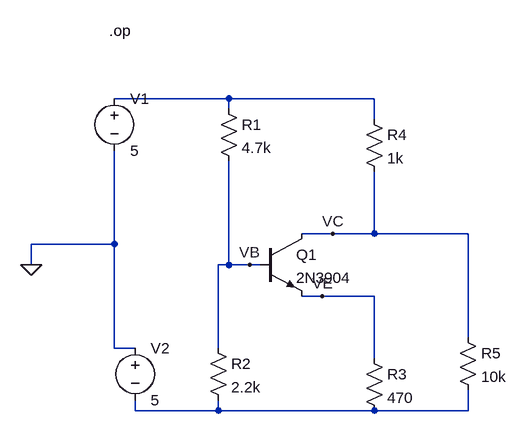
[diagram p0: schematic transistor.asc]
transistor.asc, the LTspice schematic file:
Version 4.1
SHEET 1 880 680
WIRE 80 -160 -96 -160
WIRE 304 -160 80 -160
WIRE 80 -144 80 -160
WIRE 304 -128 304 -160
WIRE 240 48 192 48
WIRE 304 48 304 -48
WIRE 304 48 240 48
WIRE 448 48 304 48
WIRE -96 64 -96 -80
WIRE -96 64 -224 64
WIRE -224 96 -224 64
WIRE 80 96 80 -64
WIRE 80 96 64 96
WIRE 112 96 80 96
WIRE 128 96 112 96
WIRE 224 144 192 144
WIRE 304 144 224 144
WIRE 448 208 448 48
WIRE -96 224 -96 64
WIRE -64 224 -96 224
WIRE 64 224 64 96
WIRE 304 240 304 144
WIRE -64 320 -64 304
WIRE 64 320 64 304
WIRE 64 320 -64 320
WIRE 304 320 64 320
WIRE 448 320 448 288
WIRE 448 320 304 320
FLAG -224 96 0
FLAG 112 96 VB
FLAG 224 144 VE
FLAG 240 48 VC
SYMBOL npn 128 48 R0
SYMATTR InstName Q1
SYMATTR Value 2N3904
SYMBOL voltage -96 -176 R0
WINDOW 123 0 0 Left 0
WINDOW 39 0 0 Left 0
SYMATTR InstName V1
SYMATTR Value 5
SYMBOL voltage -64 208 R0
WINDOW 123 0 0 Left 0
WINDOW 39 0 0 Left 0
SYMATTR InstName V2
SYMATTR Value 5
SYMBOL res 64 -160 R0
SYMATTR InstName R1
SYMATTR Value 4.7k
SYMBOL res 48 208 R0
SYMATTR InstName R2
SYMATTR Value 2.2k
SYMBOL res 288 224 R0
SYMATTR InstName R3
SYMATTR Value 470
SYMBOL res 288 -144 R0
SYMATTR InstName R4
SYMATTR Value 1k
SYMBOL res 432 192 R0
SYMATTR InstName R5
SYMATTR Value 10k
TEXT -104 -264 Left 2 !.op

The netlist it stands for:
* transistor.asc
Q1 VC VB VE 0 2N3904
V1 N001 0 5
V2 0 N002 5
R1 N001 VB 4.7k
R2 VB N002 2.2k
R3 VE N002 470
R4 N001 VC 1k
R5 VC N002 10k
.model NPN NPN
.model PNP PNP
.lib standard.bjt
.op
.backanno
.end